# Altium schematic sheet Limit_Switches.SchDoc: RP2040 CNC
size B; Author: AM; CompanyName: Expatria Technologies; DrawnBy: A.Marles; Engineer: AM; Organization: Expatria Technolgoies; DocumentNumber: 7; SheetNumber: 7; SheetTotal: 14
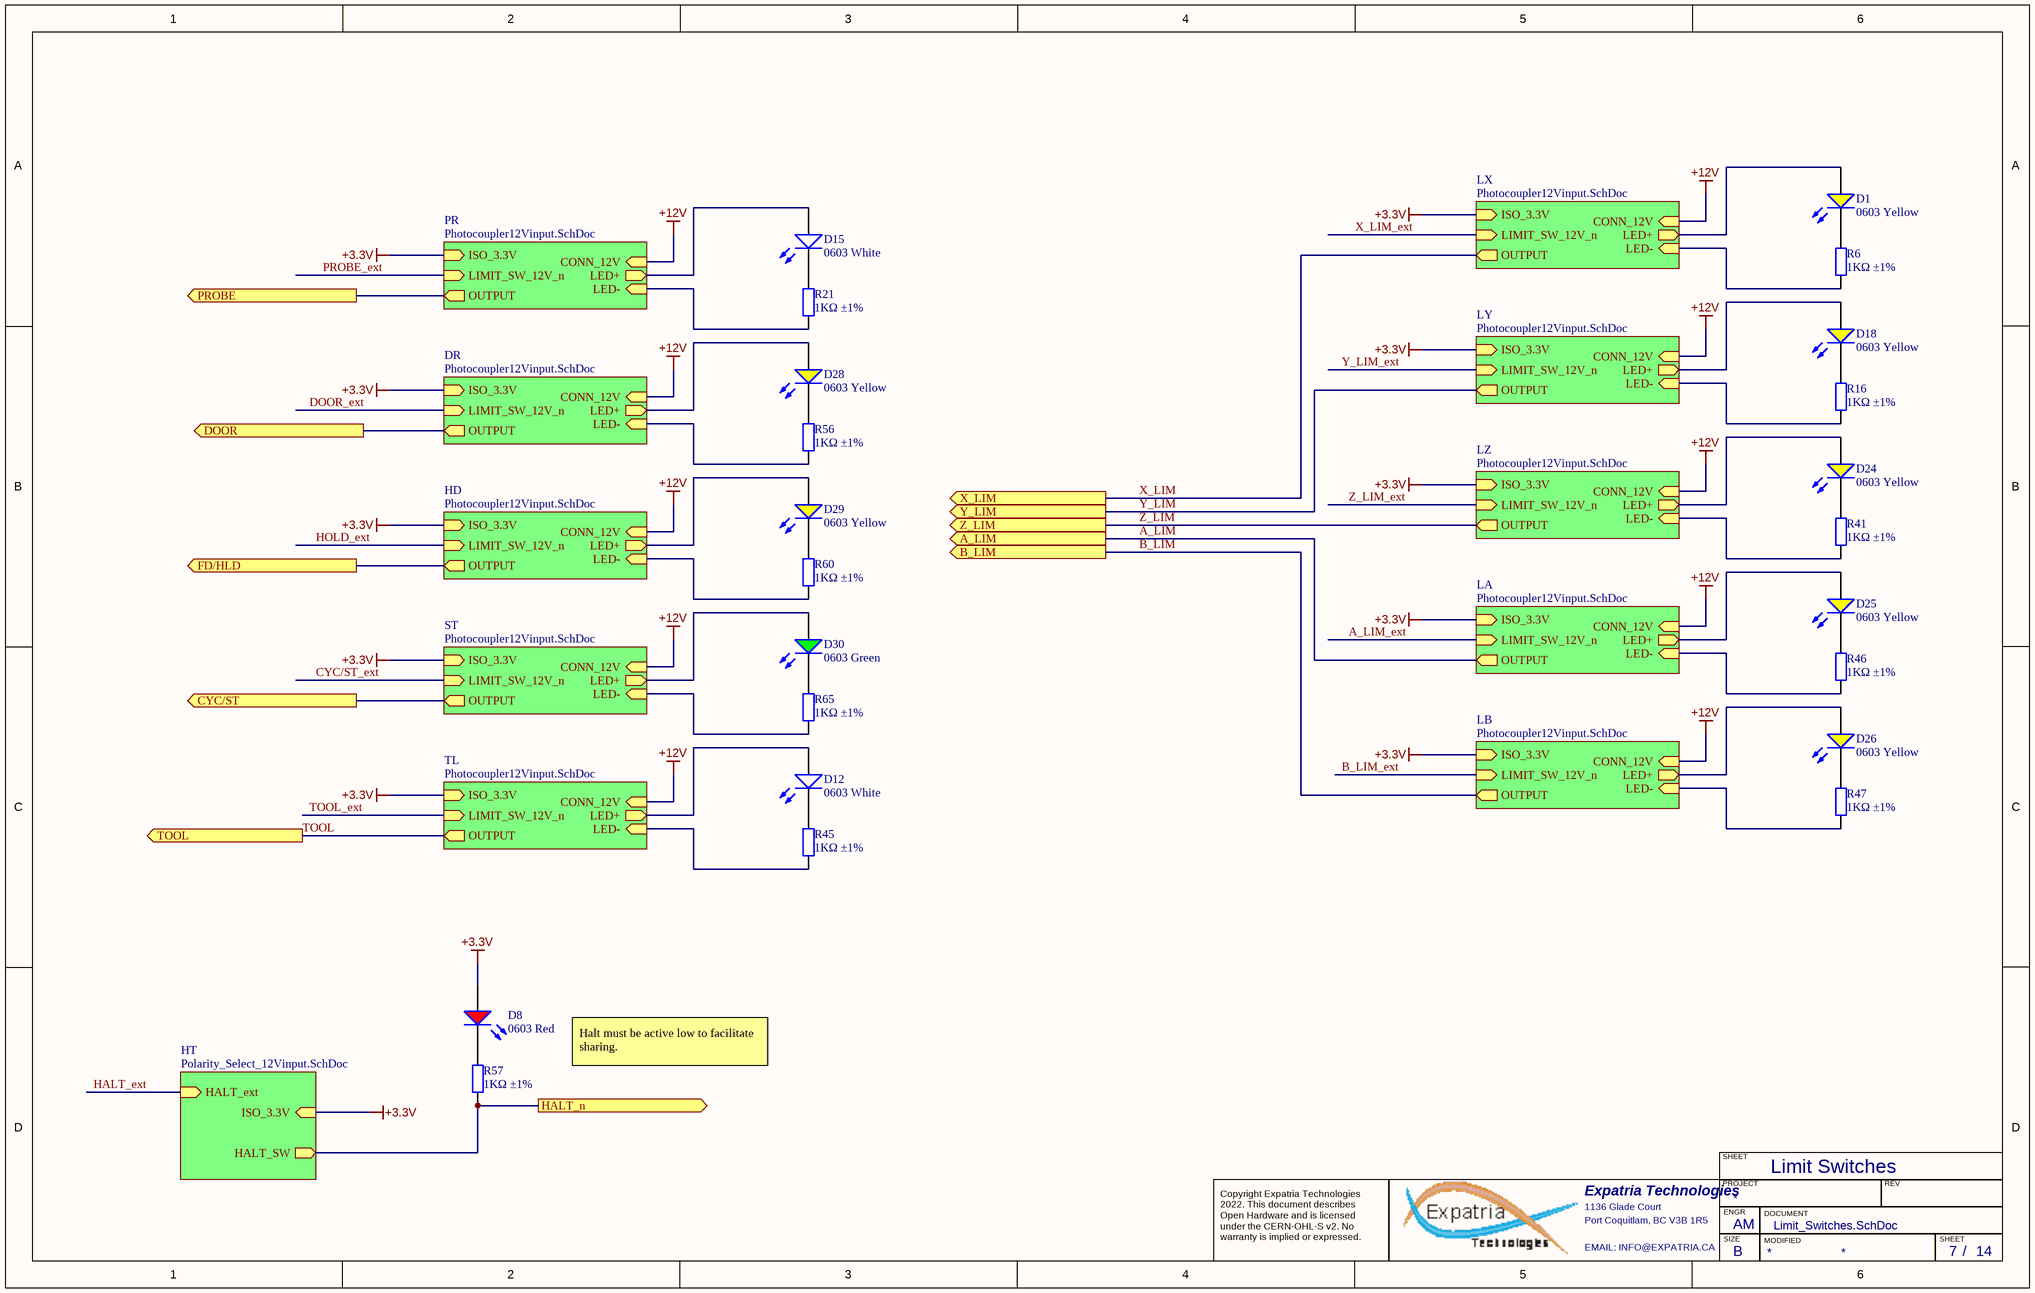
[diagram p0: Limit_Switches.SchDoc]

## Parts
D1  0603 Yellow  [0603_LED_S1]
D8  0603 Red  [0603_LED_S1]
D12  0603 White  [0603_LED_S1]
D15  0603 White  [0603_LED_S1]
D18  0603 Yellow  [0603_LED_S1]
D24  0603 Yellow  [0603_LED_S1]
D25  0603 Yellow  [0603_LED_S1]
D26  0603 Yellow  [0603_LED_S1]
D28  0603 Yellow  [0603_LED_S1]
D29  0603 Yellow  [0603_LED_S1]
D30  0603 Green  [0603_LED_S1]
R6  1KΩ ±1%  [0402_R]
R16  1KΩ ±1%  [0402_R]
R21  1KΩ ±1%  [0402_R]
R41  1KΩ ±1%  [0402_R]
R45  1KΩ ±1%  [0402_R]
R46  1KΩ ±1%  [0402_R]
R47  1KΩ ±1%  [0402_R]
R56  1KΩ ±1%  [0402_R]
R57  1KΩ ±1%  [0402_R]
R60  1KΩ ±1%  [0402_R]
R65  1KΩ ±1%  [0402_R]

## Sub-sheets
DR = Photocoupler12Vinput.SchDoc: OUTPUT (out), LED+ (out), LED- (in), CONN_12V (in), ISO_3.3V (in), LIMIT_SW_12V_n (in)
HD = Photocoupler12Vinput.SchDoc: OUTPUT (out), LED+ (out), LED- (in), CONN_12V (in), ISO_3.3V (in), LIMIT_SW_12V_n (in)
HT = Polarity_Select_12Vinput.SchDoc: ISO_3.3V (in), HALT_SW (out), HALT_ext (in)
LA = Photocoupler12Vinput.SchDoc: OUTPUT (out), LED+ (out), LED- (in), CONN_12V (in), ISO_3.3V (in), LIMIT_SW_12V_n (in)
LB = Photocoupler12Vinput.SchDoc: OUTPUT (out), LED+ (out), LED- (in), CONN_12V (in), ISO_3.3V (in), LIMIT_SW_12V_n (in)
LX = Photocoupler12Vinput.SchDoc: OUTPUT (out), LED+ (out), LED- (in), CONN_12V (in), ISO_3.3V (in), LIMIT_SW_12V_n (in)
LY = Photocoupler12Vinput.SchDoc: OUTPUT (out), LED+ (out), LED- (in), CONN_12V (in), ISO_3.3V (in), LIMIT_SW_12V_n (in)
LZ = Photocoupler12Vinput.SchDoc: OUTPUT (out), LED+ (out), LED- (in), CONN_12V (in), ISO_3.3V (in), LIMIT_SW_12V_n (in)
PR = Photocoupler12Vinput.SchDoc: OUTPUT (out), LED+ (out), LED- (in), CONN_12V (in), ISO_3.3V (in), LIMIT_SW_12V_n (in)
ST = Photocoupler12Vinput.SchDoc: OUTPUT (out), LED+ (out), LED- (in), CONN_12V (in), ISO_3.3V (in), LIMIT_SW_12V_n (in)
TL = Photocoupler12Vinput.SchDoc: OUTPUT (out), LED+ (out), LED- (in), CONN_12V (in), ISO_3.3V (in), LIMIT_SW_12V_n (in)

## Ports
A_LIM (out), B_LIM (out), CYC/ST (out), DOOR (out), FD/HLD (out), HALT_n (out), PROBE (out), TOOL (out), X_LIM (out), Y_LIM (out), Z_LIM (out)

## Nets
+3.3V: D8.A ; sheet LX/ISO_3.3V, sheet LY/ISO_3.3V, sheet LZ/ISO_3.3V, sheet LA/ISO_3.3V, sheet LB/ISO_3.3V, sheet TL/ISO_3.3V, sheet HT/ISO_3.3V, sheet PR/ISO_3.3V, sheet DR/ISO_3.3V, sheet HD/ISO_3.3V, sheet ST/ISO_3.3V
+12V: sheet LX/CONN_12V, sheet LY/CONN_12V, sheet LZ/CONN_12V, sheet LA/CONN_12V, sheet LB/CONN_12V, sheet TL/CONN_12V, sheet PR/CONN_12V, sheet DR/CONN_12V, sheet HD/CONN_12V, sheet ST/CONN_12V
A_LIM: port A_LIM, sheet LA/OUTPUT
A_LIM_ext: sheet LA/LIMIT_SW_12V_n
B_LIM: port B_LIM, sheet LB/OUTPUT
B_LIM_ext: sheet LB/LIMIT_SW_12V_n
CYC/ST: port CYC/ST, sheet ST/OUTPUT
CYC/ST_ext: sheet ST/LIMIT_SW_12V_n
DOOR: port DOOR, sheet DR/OUTPUT
DOOR_ext: sheet DR/LIMIT_SW_12V_n
FD/HLD: port FD/HLD, sheet HD/OUTPUT
HALT_ext: sheet HT/HALT_ext
HALT_n: R57.2 ; port HALT_n, sheet HT/HALT_SW
HOLD_ext: sheet HD/LIMIT_SW_12V_n
PROBE: port PROBE, sheet PR/OUTPUT
PROBE_ext: sheet PR/LIMIT_SW_12V_n
TOOL: port TOOL, sheet TL/OUTPUT
TOOL_ext: sheet TL/LIMIT_SW_12V_n
X_LIM: port X_LIM, sheet LX/OUTPUT
X_LIM_ext: sheet LX/LIMIT_SW_12V_n
Y_LIM: port Y_LIM, sheet LY/OUTPUT
Y_LIM_ext: sheet LY/LIMIT_SW_12V_n
Z_LIM: port Z_LIM, sheet LZ/OUTPUT
Z_LIM_ext: sheet LZ/LIMIT_SW_12V_n
NetD1_A: D1.A ; sheet LX/LED+
NetD1_K: D1.K R6.1
NetD8_K: D8.K R57.1
NetD12_A: D12.A ; sheet TL/LED+
NetD12_K: D12.K R45.1
NetD15_A: D15.A ; sheet PR/LED+
NetD15_K: D15.K R21.1
NetD18_A: D18.A ; sheet LY/LED+
NetD18_K: D18.K R16.1
NetD24_A: D24.A ; sheet LZ/LED+
NetD24_K: D24.K R41.1
NetD25_A: D25.A ; sheet LA/LED+
NetD25_K: D25.K R46.1
NetD26_A: D26.A ; sheet LB/LED+
NetD26_K: D26.K R47.1
NetD28_A: D28.A ; sheet DR/LED+
NetD28_K: D28.K R56.1
NetD29_A: D29.A ; sheet HD/LED+
NetD29_K: D29.K R60.1
NetD30_A: D30.A ; sheet ST/LED+
NetD30_K: D30.K R65.1
NetR6_2: R6.2 ; sheet LX/LED-
NetR16_2: R16.2 ; sheet LY/LED-
NetR21_2: R21.2 ; sheet PR/LED-
NetR41_2: R41.2 ; sheet LZ/LED-
NetR45_2: R45.2 ; sheet TL/LED-
NetR46_2: R46.2 ; sheet LA/LED-
NetR47_2: R47.2 ; sheet LB/LED-
NetR56_2: R56.2 ; sheet DR/LED-
NetR60_2: R60.2 ; sheet HD/LED-
NetR65_2: R65.2 ; sheet ST/LED-

## Notes on the sheet
- Halt must be active low to facilitate sharing.
- Limit Switches
- SHEET
- Expatria Technologies
- 1136 Glade Court
- Port Coquitlam, BC V3B 1R5
- PROJECT
- SIZE
- ENGR
- MODIFIED
- DOCUMENT
- REV
- Copyright Expatria Technologies 2022. This document describes Open Hardware and is licensed under the CERN-OHL-S v2. No warranty is implied or expressed.
- EMAIL: INFO@EXPATRIA.CA
- B
- /

## Library data of the parts
D1 D18 D24-D26 D28 D29 = 0603 LED Yellow: LED; ComponentLink1Description: 供应商链接; ComponentLink1URL: http://www.szlcsc.com/product/details_73147.html; Package: 0603; Supplier: LC; SuppliersPartNumber: C72038; Color: Yellow
D8 = 0603 LED Red: LED; ComponentLink1Description: 供应商链接; ComponentLink1URL: http://www.szlcsc.com/product/details_2659.html; Package: 0603; Supplier: LC; SuppliersPartNumber: C2286; Color: Red
D12 D15 = 0603 LED White: LED; ComponentLink1Description: 供应商链接; ComponentLink1URL: http://www.szlcsc.com/product/details_2663.html; Package: 0603; Supplier: LC; SuppliersPartNumber: C2290; Color: White
D30 = 0603 LED Green: LED; ComponentLink1Description: 供应商链接; ComponentLink1URL: http://www.szlcsc.com/product/details_73152.html; Package: 0603; Supplier: LC; SuppliersPartNumber: C72043; Color: Green
R6 R16 R21 R41 R45-R47 R56 R57 R60 R65 = 0402 1K (1001) 1%: Chip resistor; Manufacturer: Uniroyal Elec; PartNumber: 0402WGF1001TCE; Power: 1/16W; ComponentLink1Description: Supplier link; ComponentLink1URL: http://www.szlcsc.com/product/details_12256.html; Package: 0402; Supplier: LC; SuppliersPartNumber: C11702; Resistance: 1KΩ; Tolerance: 1%